# Altium project WR_NIC.PrjPcb (part 3 of 6)

## Sheet 09-DPLL-3.SchDoc
size B; SheetNumber: 9; SheetTotal: 22
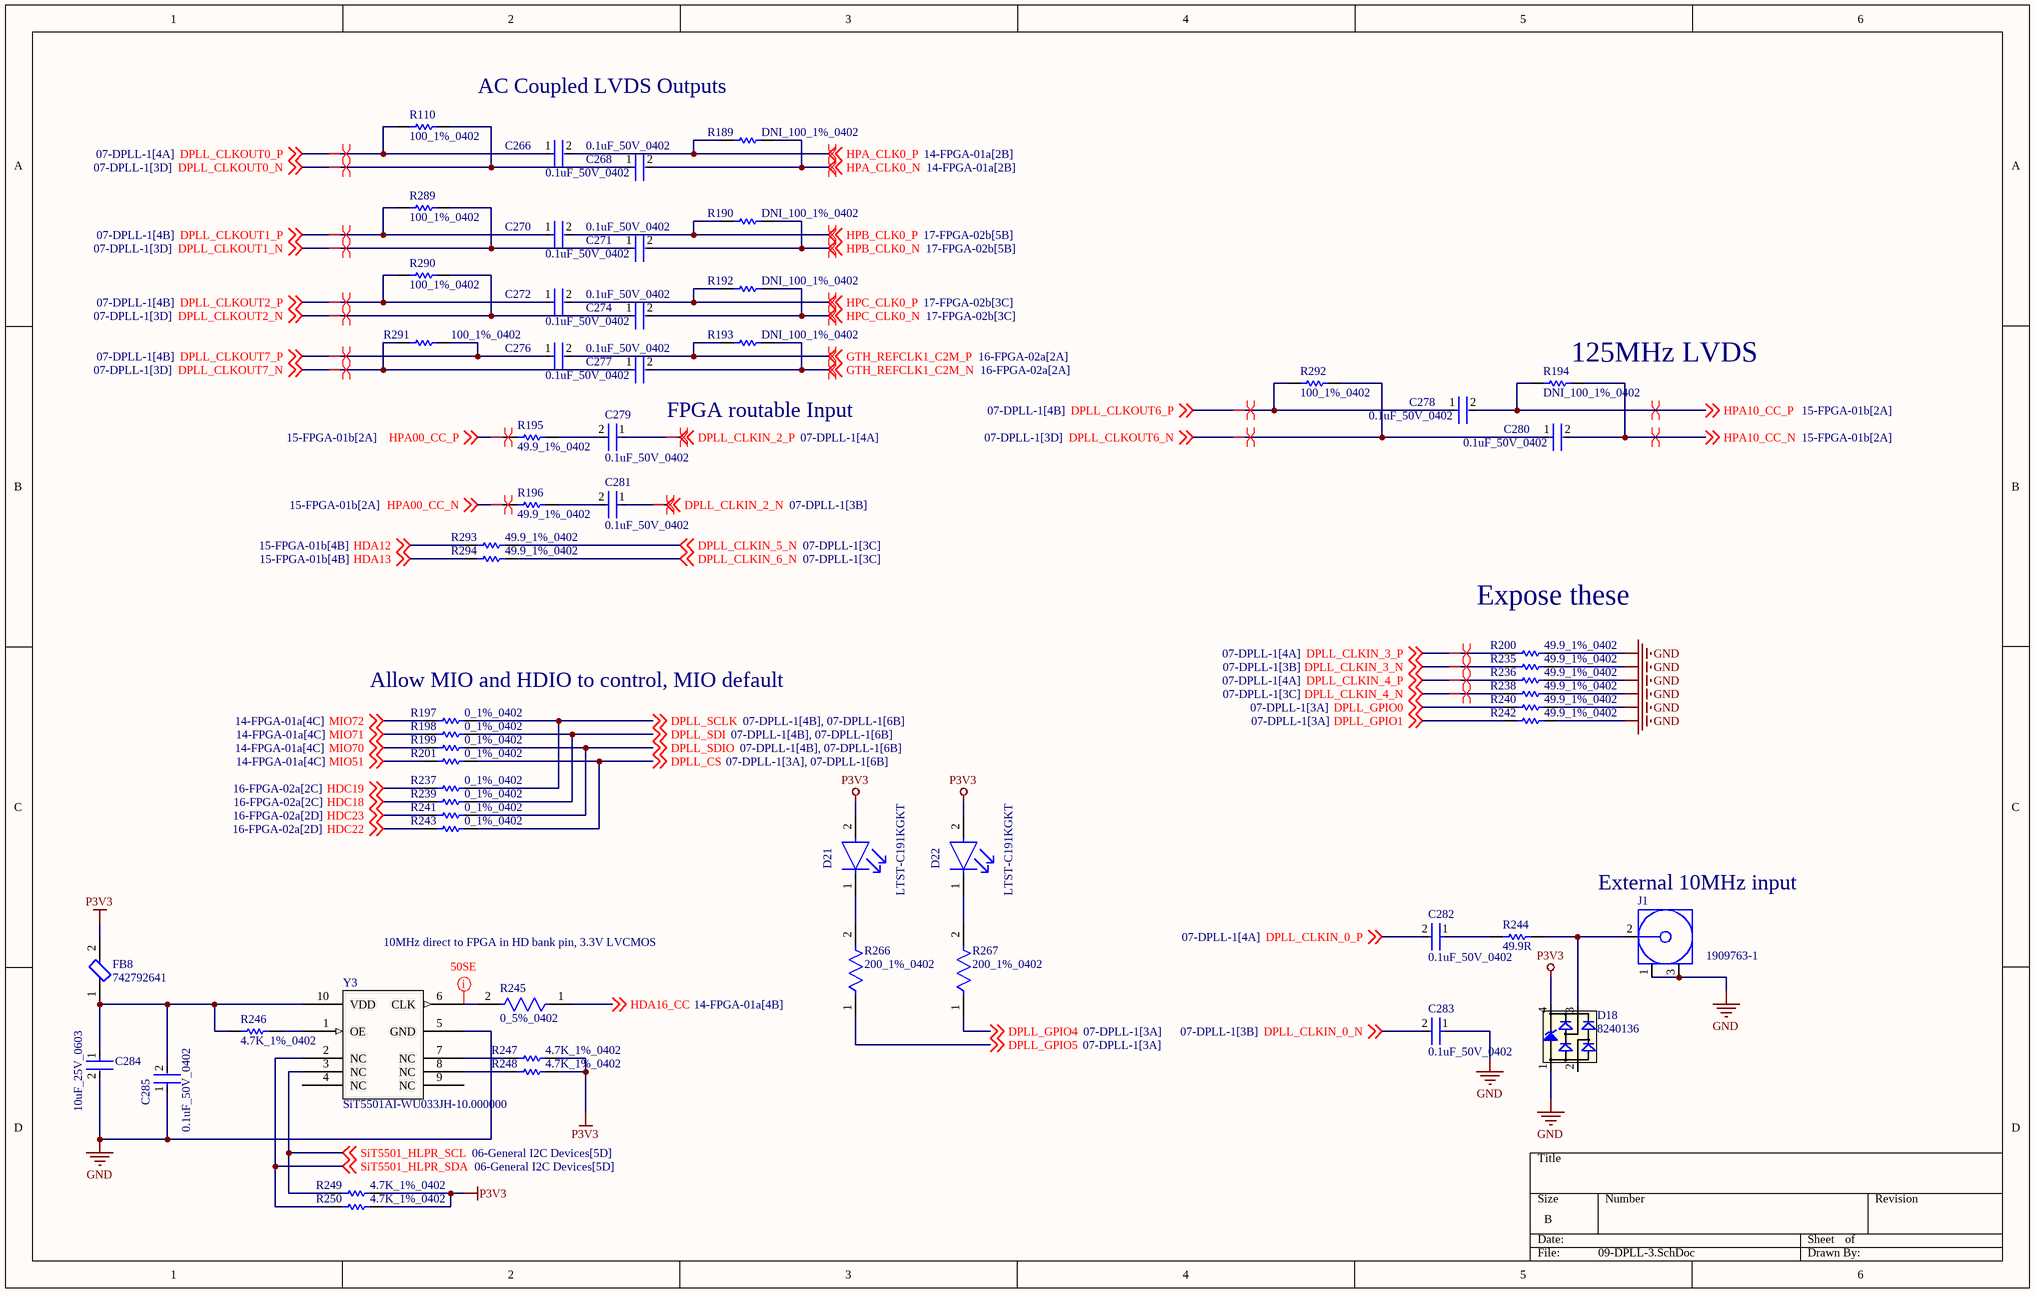
[diagram p8: 09-DPLL-3.SchDoc]

### Parts
C266  0.1uF_50V_0402  [FP-C1005-050-0_05-IPC_C]
C268  0.1uF_50V_0402  [FP-C1005-050-0_05-IPC_C]
C270  0.1uF_50V_0402  [FP-C1005-050-0_05-IPC_C]
C271  0.1uF_50V_0402  [FP-C1005-050-0_05-IPC_C]
C272  0.1uF_50V_0402  [FP-C1005-050-0_05-IPC_C]
C274  0.1uF_50V_0402  [FP-C1005-050-0_05-IPC_C]
C276  0.1uF_50V_0402  [FP-C1005-050-0_05-IPC_C]
C277  0.1uF_50V_0402  [FP-C1005-050-0_05-IPC_C]
C278  0.1uF_50V_0402  [FP-C1005-050-0_05-IPC_C]
C279  0.1uF_50V_0402  [FP-C1005-050-0_05-IPC_C]
C280  0.1uF_50V_0402  [FP-C1005-050-0_05-IPC_C]
C281  0.1uF_50V_0402  [FP-C1005-050-0_05-IPC_C]
C282  0.1uF_50V_0402  [FP-C1005-050-0_05-IPC_C]
C283  0.1uF_50V_0402  [FP-C1005-050-0_05-IPC_C]
C284  10uF_25V_0603  [FP-CL10-IPC_C]
C285  0.1uF_50V_0402  [FP-C1005-050-0_05-IPC_C]
D18  8240136  [SOT143-4L]
D21  LTST-C191KGKT  [FP-LTST-C191KGKT-MFG]
D22  LTST-C191KGKT  [FP-LTST-C191KGKT-MFG]
FB8  742792641  [FP-742792641-MFG]
J1  1909763-1  [TECO-1909763-1_V]
R110  100_1%_0402  [RESC1005X40X25ML05T10]
R189  DNI_100_1%_0402  [RESC1005X40X25LL05T05]  (no BOM)
R190  DNI_100_1%_0402  [RESC1005X40X25LL05T05]  (no BOM)
R192  DNI_100_1%_0402  [RESC1005X40X25LL05T05]  (no BOM)
R193  DNI_100_1%_0402  [RESC1005X40X25LL05T05]
R194  DNI_100_1%_0402  [RESC1005X40X25ML05T10]  (no BOM)
R195  49.9_1%_0402  [RESC1005X40X25NL10T10]
R196  49.9_1%_0402  [RESC1005X40X25NL10T10]
R197  0_1%_0402  [RESC1005X40X25LL05T05]
R198  0_1%_0402  [RESC1005X40X25LL05T05]
R199  0_1%_0402  [RESC1005X40X25LL05T05]
R200  49.9_1%_0402  [RESC1005X40X25NL10T10]
R201  0_1%_0402  [RESC1005X40X25LL05T05]
R235  49.9_1%_0402  [RESC1005X40X25NL10T10]
R236  49.9_1%_0402  [RESC1005X40X25NL10T10]
R237  0_1%_0402  [RESC1005X40X25LL05T05]
R238  49.9_1%_0402  [RESC1005X40X25NL10T10]
R239  0_1%_0402  [RESC1005X40X25LL05T05]
R240  49.9_1%_0402  [RESC1005X40X25NL10T10]
R241  0_1%_0402  [RESC1005X40X25LL05T05]
R242  49.9_1%_0402  [RESC1005X40X25NL10T10]
R243  0_1%_0402  [RESC1005X40X25LL05T05]
R244  49.9R  [RESC1608X55X25NL10T15]
R245  0_5%_0402  [FP-AC0402-0_37-IPC_B]
R246  4.7K_1%_0402  [RESC1005X40X25NL10T10]
R247  4.7K_1%_0402  [RESC1005X40X25NL10T10]
R248  4.7K_1%_0402  [RESC1005X40X25NL10T10]
R249  4.7K_1%_0402  [RESC1005X40X25NL10T10]
R250  4.7K_1%_0402  [RESC1005X40X25NL10T10]
R266  200_1%_0402  [FP-ERJ2RK-IPC_A]
R267  200_1%_0402  [FP-ERJ2RK-IPC_A]
R289  100_1%_0402  [RESC1005X40X25ML05T10]
R290  100_1%_0402  [RESC1005X40X25ML05T10]
R291  100_1%_0402  [RESC1005X40X25ML05T10]
R292  100_1%_0402  [RESC1005X40X25ML05T10]
R293  49.9_1%_0402  [RESC1005X40X25NL10T10]
R294  49.9_1%_0402  [RESC1005X40X25NL10T10]
Y3  Manufacturer Part Number: SiT5501AI-WU033JH-10.000000  [SITIME_SPL-086-CQFN-010-C07050_REV_DRAFT]  (hidden comment: SiTime_SiT5501AC-WU-33E0-10T)

### Nets
GND: C283.1 C284.2 C285.1 D18.1(GND) J1.1 J1.3 R200.2 R235.2 R236.2 R238.2 R240.2 R242.2 Y3.5(GND)
P3V3: D18.4(VDD) D21.2(A) D22.2(A) FB8.2 R247.2 R248.2 R249.2 R250.2
DPLL_CLKIN_0_N: C283.2 ; off-sheet DPLL_CLKIN_0_N
DPLL_CLKIN_0_P: C282.2 ; off-sheet DPLL_CLKIN_0_P
DPLL_CLKIN_2_N: C281.1 ; off-sheet DPLL_CLKIN_2_N
DPLL_CLKIN_2_P: C279.1 ; off-sheet DPLL_CLKIN_2_P
DPLL_CLKIN_3_N: R235.1 ; off-sheet DPLL_CLKIN_3_N
DPLL_CLKIN_3_P: R200.1 ; off-sheet DPLL_CLKIN_3_P
DPLL_CLKIN_4_N: R238.1 ; off-sheet DPLL_CLKIN_4_N
DPLL_CLKIN_4_P: R236.1 ; off-sheet DPLL_CLKIN_4_P
DPLL_CLKIN_5_N: R293.2 ; off-sheet DPLL_CLKIN_5_N
DPLL_CLKIN_6_N: R294.2 ; off-sheet DPLL_CLKIN_6_N
DPLL_CLKOUT0_N: C268.1 R110.2 ; off-sheet DPLL_CLKOUT0_N
DPLL_CLKOUT0_P: C266.1 R110.1 ; off-sheet DPLL_CLKOUT0_P
DPLL_CLKOUT1_N: C271.1 R289.2 ; off-sheet DPLL_CLKOUT1_N
DPLL_CLKOUT1_P: C270.1 R289.1 ; off-sheet DPLL_CLKOUT1_P
DPLL_CLKOUT2_N: C274.1 R290.2 ; off-sheet DPLL_CLKOUT2_N
DPLL_CLKOUT2_P: C272.1 R290.1 ; off-sheet DPLL_CLKOUT2_P
DPLL_CLKOUT6_N: C280.1 R292.2 ; off-sheet DPLL_CLKOUT6_N
DPLL_CLKOUT6_P: C278.1 R292.1 ; off-sheet DPLL_CLKOUT6_P
DPLL_CLKOUT7_N: C277.1 R291.1 ; off-sheet DPLL_CLKOUT7_N
DPLL_CLKOUT7_P: C276.1 R291.2 ; off-sheet DPLL_CLKOUT7_P
DPLL_CS: R201.2 R243.2 ; off-sheet DPLL_CS
DPLL_GPIO0: R240.1 ; off-sheet DPLL_GPIO0
DPLL_GPIO1: R242.1 ; off-sheet DPLL_GPIO1
DPLL_GPIO4: R267.1 ; off-sheet DPLL_GPIO4
DPLL_GPIO5: R266.1 ; off-sheet DPLL_GPIO5
DPLL_SCLK: R197.2 R237.2 ; off-sheet DPLL_SCLK
DPLL_SDI: R198.2 R239.2 ; off-sheet DPLL_SDI
DPLL_SDIO: R199.2 R241.2 ; off-sheet DPLL_SDIO
GTH_REFCLK1_C2M_N: C277.2 R193.2 ; off-sheet GTH_REFCLK1_C2M_N
GTH_REFCLK1_C2M_P: C276.2 R193.1 ; off-sheet GTH_REFCLK1_C2M_P
HDA12: R293.1 ; off-sheet HDA12
HDA13: R294.1 ; off-sheet HDA13
HDA16_CC: R245.1 ; off-sheet HDA16_CC
HDC18: R239.1 ; off-sheet HDC18
HDC19: R237.1 ; off-sheet HDC19
HDC22: R243.1 ; off-sheet HDC22
HDC23: R241.1 ; off-sheet HDC23
HPA00_CC_N: R196.1 ; off-sheet HPA00_CC_N
HPA00_CC_P: R195.1 ; off-sheet HPA00_CC_P
HPA10_CC_N: C280.2 R194.2 ; off-sheet HPA10_CC_N
HPA10_CC_P: C278.2 R194.1 ; off-sheet HPA10_CC_P
HPA_CLK0_N: C268.2 R189.2 ; off-sheet HPA_CLK0_N
HPA_CLK0_P: C266.2 R189.1 ; off-sheet HPA_CLK0_P
HPB_CLK0_N: C271.2 R190.2 ; off-sheet HPB_CLK0_N
HPB_CLK0_P: C270.2 R190.1 ; off-sheet HPB_CLK0_P
HPC_CLK0_N: C274.2 R192.2 ; off-sheet HPC_CLK0_N
HPC_CLK0_P: C272.2 R192.1 ; off-sheet HPC_CLK0_P
MIO51: R201.1 ; off-sheet MIO51
MIO70: R199.1 ; off-sheet MIO70
MIO71: R198.1 ; off-sheet MIO71
MIO72: R197.1 ; off-sheet MIO72
SiT5501_HLPR_SCL: R249.1 Y3.3(NC) ; off-sheet SiT5501_HLPR_SCL
SiT5501_HLPR_SDA: R250.1 Y3.2(NC) ; off-sheet SiT5501_HLPR_SDA
NetC279_2: C279.2 R195.2
NetC281_2: C281.2 R196.2
NetC282_1: C282.1 R244.1
NetC284_1: C284.1 C285.2 FB8.1 R246.2 Y3.10(VDD)
NetD18_3: D18.3(I/O2) J1.2 R244.2
NetD21_1: D21.1(C) R266.2
NetD22_1: D22.1(C) R267.2
NetR245_2: R245.2 Y3.6(CLK)
NetR246_1: R246.1 Y3.1(OE)
NetR247_1: R247.1 Y3.7(NC)
NetR248_1: R248.1 Y3.8(NC)

Not connected (* = marked no-connect by the designer): D18 2(I/O1); Y3 4(NC) 9(NC)

### Layout directives
differential pair: DPLL_CLKIN_2_N, DPLL_CLKIN_2_P, DPLL_CLKIN_3_N, DPLL_CLKIN_3_P, DPLL_CLKIN_4_N, DPLL_CLKIN_4_P, DPLL_CLKOUT0_N, DPLL_CLKOUT0_P, DPLL_CLKOUT1_N, DPLL_CLKOUT1_P, DPLL_CLKOUT2_N, DPLL_CLKOUT2_P, DPLL_CLKOUT6_N, DPLL_CLKOUT6_P, DPLL_CLKOUT7_N, DPLL_CLKOUT7_P, GTH_REFCLK1_C2M_N, GTH_REFCLK1_C2M_P, HPA00_CC_N, HPA00_CC_P, HPA10_CC_N, HPA10_CC_P, HPA_CLK0_N, HPA_CLK0_P, HPB_CLK0_N, HPB_CLK0_P, HPC_CLK0_N, HPC_CLK0_P
net class 50SE: NetR245_2

### Notes on the sheet
- AC Coupled LVDS Outputs
- (near R194) 125MHz LVDS
- FPGA routable Input
- Expose these
- Allow MIO and HDIO to control, MIO default
- (near J1) External 10MHz input
- 10MHz direct to FPGA in HD bank pin, 3.3V LVCMOS

### Library data of the parts
C266 C268 C270-C272 C274 C276-C283 C285 = CMP-2000-05393-2: Multilayer Ceramic Capacitors 100nF ±10% 50V X7R SMD 0402; Voltage: 50V; Dielectric Material: Ceramic; Min Operating Temperature: -55°C; Depth: 0.5mm; Radiation Hardening: No; RoHS Compliant: Yes; Voltage Rating (DC): 50V; Lead Free: Lead Free; Resistor Type: Ceramic; Height: 0.5mm; Dielectric: X7R; Thickness: 0.022inch; Case/Package: 0402; Case Code (Metric): 1005; Termination: SMD/SMT; Capacitance: 100nF; Packaging: Tape and Reel; Max Operating Temperature: 125°C; Mount: Surface Mount; Package Quantity: 1; Width: 0.02inch; Weight: 2.3E-05oz; Voltage Rating: 50V; Tolerance: 10%; Construction: Flat; Case Code (Imperial): 0402; Length: 1mm; REACH SVHC: No SVHC; Series: C
C284 = CMP-13271-004224-1: Cap Ceramic 10uF 25V X5R ±20% Pad SMD 0603 +85°C T/R; Width: 0.031inch; Voltage Rating: 25V; Length: 0.063inch; Case Code (Metric): 1608; Dielectric: X5R; Termination: Wraparound; Capacitance: 10uF; Lead Free: Lead Free; Mount: Surface Mount; Package Quantity: 1; Case Code (Imperial): 0603; Thickness: 0.035inch; Packaging: Tape and Reel; Contact Plating: Tin; Min Operating Temperature: -55°C; Tolerance: 20%; Max Operating Temperature: 85°C; Case/Package: 0603
D18 = CMP-1486-00002-1: TVS Diode WE-TVS-HS, VRWM=3.3V; Manufacturer: Wuerth Elektronik; Reverse Stand Off Voltage: 3.3V; PartNumber: 8240136; ComponentLink1Description: Manufacturer URL; PackageReference: SOT143-4L; ComponentLink1URL: http://www.we-online.com; ComponentLink2Description: Datasheet; ComponentLink2URL: http://katalog.we-online.de/kataloge/eisos/media/pdf/8240136.pdf
D21 D22 = CMP-2000-05198-2: LED GREEN CLEAR SMD; Max Power Dissipation: 75mW; Forward Current: 30mA; Reverse Voltage: 5V; Lens Color: Colorless; Forward Voltage: 2V; Dominant Wavelength: 571nm; Number of LEDs: 1; Viewing Angle: 130°; Lens Style: Rectangular; Test Current: 20mA; Luminous Intensity: 35mcd; Wavelength: 574nm; Width: 0.8mm; Case Code (Imperial): 0603; Number of Pins: 2; Lead Free: Lead Free; Packaging: Tape and Reel; Package Quantity: 1; Min Operating Temperature: -55°C; Case/Package: 0603; Length: 1.6mm; Power Dissipation: 75mW; Depth: 0.8mm; Radiation Hardening: No; Mount: Surface Mount; Max Operating Temperature: 85°C; Color: Green; Power Rating: 75mW; Height: 0.55mm; Illumination Color: Green; Case Code (Metric): 1608; Lens Transparency: Clear; Number of Elements: 1
FB8 = CMP-0220-00171-2: FERRITE BEAD 300 OHM 0603 1LN; Inductance: 18nH; Max DC Current: 2A; Number of Lines: 1; Test Frequency: 100MHz; Impedance: 300R; DC Resistance (DCR): 150mR; Tolerance: 25%; Case Code (Metric): 1608; Core Material: Ferrite; Length: 1.6mm; Lead Free: Lead Free; Series: WE-CBF; Min Operating Temperature: -55°C; RoHS Compliant: Yes; Case/Package: SMD/SMT; Material: Ferrite; Max Operating Temperature: 125°C; Termination: SMD/SMT; Packaging: Tape and Reel; Weight: 0.000141oz; Case Code (Imperial): 0603; Width: 0.8mm; Mount: Surface Mount; Max Current Rating: 2A; Package Quantity: 1; Depth: 0.8mm; Current Rating: 2A; Height: 0.8mm
J1 = CMP-2000-07505-1: Ultra Miniature Coaxial Connector Jack, 60 V, 50 Ohm, -40 to 90 degC, RoHS, Tape and Reel; Manufacturer: TE Connectivity; Gender: Female; PCB Mounting Orientation: Vertical; Body Material: LiquidCrystalPolymer; Case\/Package: SMD/SMT; Impedance: 50Ohm; Max Frequency: 6GHz; Body Plating: Gold; Dielectric Material: Polymer; Orientation: Straight; Mount: SurfaceMount; Length: 3mm; Packaging: TapeandReel; Connector Type: Jack; Lead Free: LeadFree; Package Quantity: 1; Termination: SMD/SMT; Contact Material: CopperAlloy; Fastening Type: Pull; RoHSCompliant: true; Max Operating Temperature: 90degC; Datasheet URL: http://www.te.com/commerce/DocumentDelivery/DDEController?Action=srchrtrv&DocNm=1909763&DocType=Customer+Drawing&DocLang=English; Contact Plating: Gold; Mounting Technology: SurfaceMount; Package Reference: TECO-1909763-1; Insulation Material: Thermoplastic; Min Operating Temperature: -40degC; Manufacturer URL: http://www.te.com/; ELV: Compliant; Datasheet Version: Rev. B2, 11/2015; Radiation Hardening: No; Package Description: 3-Pin Surface Mount Device, Body 2.6 x 2.6 mm; Housing Colour: Beige
R110 R194 R289-R292 = CMP-2002-06458-1: Part Number: ERJ-U02F1000X; Manufacturer: Panasonic
R189 R190 R192 R193 = CMP-2002-00605-3: Chip Resistor, 100 Ohm, +/- 1%, 100 mW, -55 to 155 degC, 0402 (1005 Metric), RoHS, Tape and Reel; Manufacturer: Basic Passives; PartNumber: ERJ-2RKF1000X; Power Rating: 100 mW; Resistance: 100 Ohm; Voltage Rating: 50 V; Case\/Package: 0402; Width: 0.5 mm; Pins: 2; ComponentLink2Description: Datasheet; PackageReference: 0402; Height: 0.35 mm; Tolerance: 1%; DatasheetVersion: 04/2015; Case Code (Imperial): 0402; Min Operating Temperature: -55 degC; Radiation Hardening: No; Length: 1 mm; Package Quantity: 10000; PackageDescription: 2-Pin Surface Mount Device, Body 1 x 0.5 mm; Mounting Technology: Surface Mount; Case Code (Metric): 1005; Packaging: Tape and Reel; ComponentLink1URL: http://www.panasonic.com/; RoHSCompliant: true; Max Operating Temperature: 155 degC; REACH SVHC: Yes; ComponentLink1Description: Manufacturer URL; ComponentLink2URL: http://industrial.panasonic.com/cdbs/www-data/pdf/RDA0000/AOA0000C86.pdf; Mount: Surface Mount
R195 R196 R200 R235 R236 R238 R240 R242 R293 R294 = CMP-2002-04448-1: Part Number: RK73H1ETTP49R9F; Manufacturer: KOA Speer
R197-R199 R201 R237 R239 R241 R243 = CMP-2000-07451-1: Chip Resistor, 0 Ohm, 0.1 W, -55 to 155 degC, 0402 (1005 Metric), RoHS, Tape and Reel; Manufacturer: Panasonic; Voltage Rating (DC): 50V; Temperature Coefficient: 600ppm/��C; Max Power Dissipation: 100mW; Resistance: 0mOhm; Tolerance: 5%; Number of Terminations: 2; Mount: SurfaceMount; Height: 0.35mm; Packaging: TapeandReel; Contact Plating: Tin; Manufacturer URL: http://www.panasonic.com/; Composition: ThickFilm; Max Operating Temperature: 155degC; REACH SVHC: NoSVHC; Case/Package: 0402; Package Reference: 402; Depth: 0.5mm; Package Description: 2-Pin Surface Mount Device, Body 1 x 0.5 mm; Datasheet URL: https://industrial.panasonic.com/cdbs/www-data/pdf/RDA0000/AOA0000C301.pdf; RoHSCompliant: True; Case Code (Imperial): 0402; Military Standard: Not; Min Operating Temperature: -55degC; Power Rating: 100mW; Datasheet Version: 03/2015; Length: 1mm; Case Code (Metric): 1005; Termination: SMD/SMT; Mounting Technology: SurfaceMount; Voltage Rating: 50V; Width: 0.02inch; Package Quantity: 1; Lead Free: LeadFree; Radiation Hardening: No
R244 = CMP-1659-00036-1: General Purpose Chip Resistor, 49.9 Ohm, +/- 1%, -55 to 155 degC, 0603 (1608 Metric), RoHS, Tape and Reel; Max Supply Voltage: 3.63 V; Case\Package: LQFP; Interface: SPI; Min Supply Voltage: 2.97 V; PackageReference: 0603; Packaging: Tray; ComponentLink2Description: Datasheet; ComponentLink1Description: Manufacturer URL; ComponentLink2URL: https://datasheet.ciiva.com/11808/0900766b80f96399-11808223.pdf; RoHSCompliant: true; Max Operating Temperature: 85 degC; ComponentLink1URL: http://www.yageo.com/; PackageDescription: 2-Pin Surface Mount Device, Body 1.6 x 0.8 mm; DatasheetVersion: Rev. 4, 04/2009; Min Operating Temperature: -40 degC; Package Quantity: 250; Pins: 48
R245 = CMP-2002-01772-2: RESISTOR 0402 JUMPER ZERO OHM; Voltage Rating: 50V; Temperature Coefficient: 200ppm/°C; Tolerance: 1%; Power Rating: 62.5mW; Resistance: 0R; Min Operating Temperature: -55°C; Termination: SMD/SMT; Case/Package: 0402; Case Code (Imperial): 0402; Packaging: Tape and Reel; Case Code (Metric): 1005; Max Operating Temperature: 155°C; Series: AC
R246-R250 = CMP-2002-05217-1: Manufacturer: Bourns; Part Number: CR0402-FX-4701GLF
R266 R267 = CMP-2002-00757-2: RES SMD 200 OHM 1% 1/10W 0402; Power Rating: 100mW; Voltage Rating (DC): 50V; Resistance: 200R; Temperature Coefficient: 100ppm/°C; RoHS Compliant: Yes; Packaging: Tape and Reel; Case Code (Metric): 1005; Package Quantity: 1; Contact Plating: Tin; Series: ERJ; Mount: Surface Mount; Lead Free: Lead Free; Min Operating Temperature: -55°C; Number of Terminations: 2; Max Power Dissipation: 100mW; Technology: THICK FILM; Voltage Rating: 50V; Case/Package: 0402; Width: 0.02inch; Termination: SMD/SMT; Military Standard: Not; Height: 0.35mm; Radiation Hardening: No; Resistance Tolerance: 1%; Length: 1mm; REACH SVHC: No SVHC; Construction: Rectangular; Depth: 0.5mm; Features: Automotive AEC-Q200; Resistor Type: Thick Film; Case Code (Imperial): 0402; Tolerance: 1%; Size Code: 0402; Max Operating Temperature: 155°C
Y3 = CMP-OSC-00029-2: OSC, MEMS, STRATUM 3E, 10.000MHZ, 10PPB STAB, LVCMOS, 3.3V, O/P EN, 7.0X5.0X2.2MM, CQFN-10; Manufacturer: SiTime; Frequency: 10 MHz; Voltage - Supply: 3.3 V; Type: OCXO; Category: Oscillators; Max Operating Temperature: 70°C; Min Operating Temperature: -20°C; Height: 2.20mm (max); Case/Package: 10 Lead QFN; Output: LVCMOS; Mounting Type: Surface Mount; Frequency Stability: ±10 ppb; RoHS: Yes

## Sheet 10-JTAG.SchDoc
size C; SheetNumber: 10; SheetTotal: 22
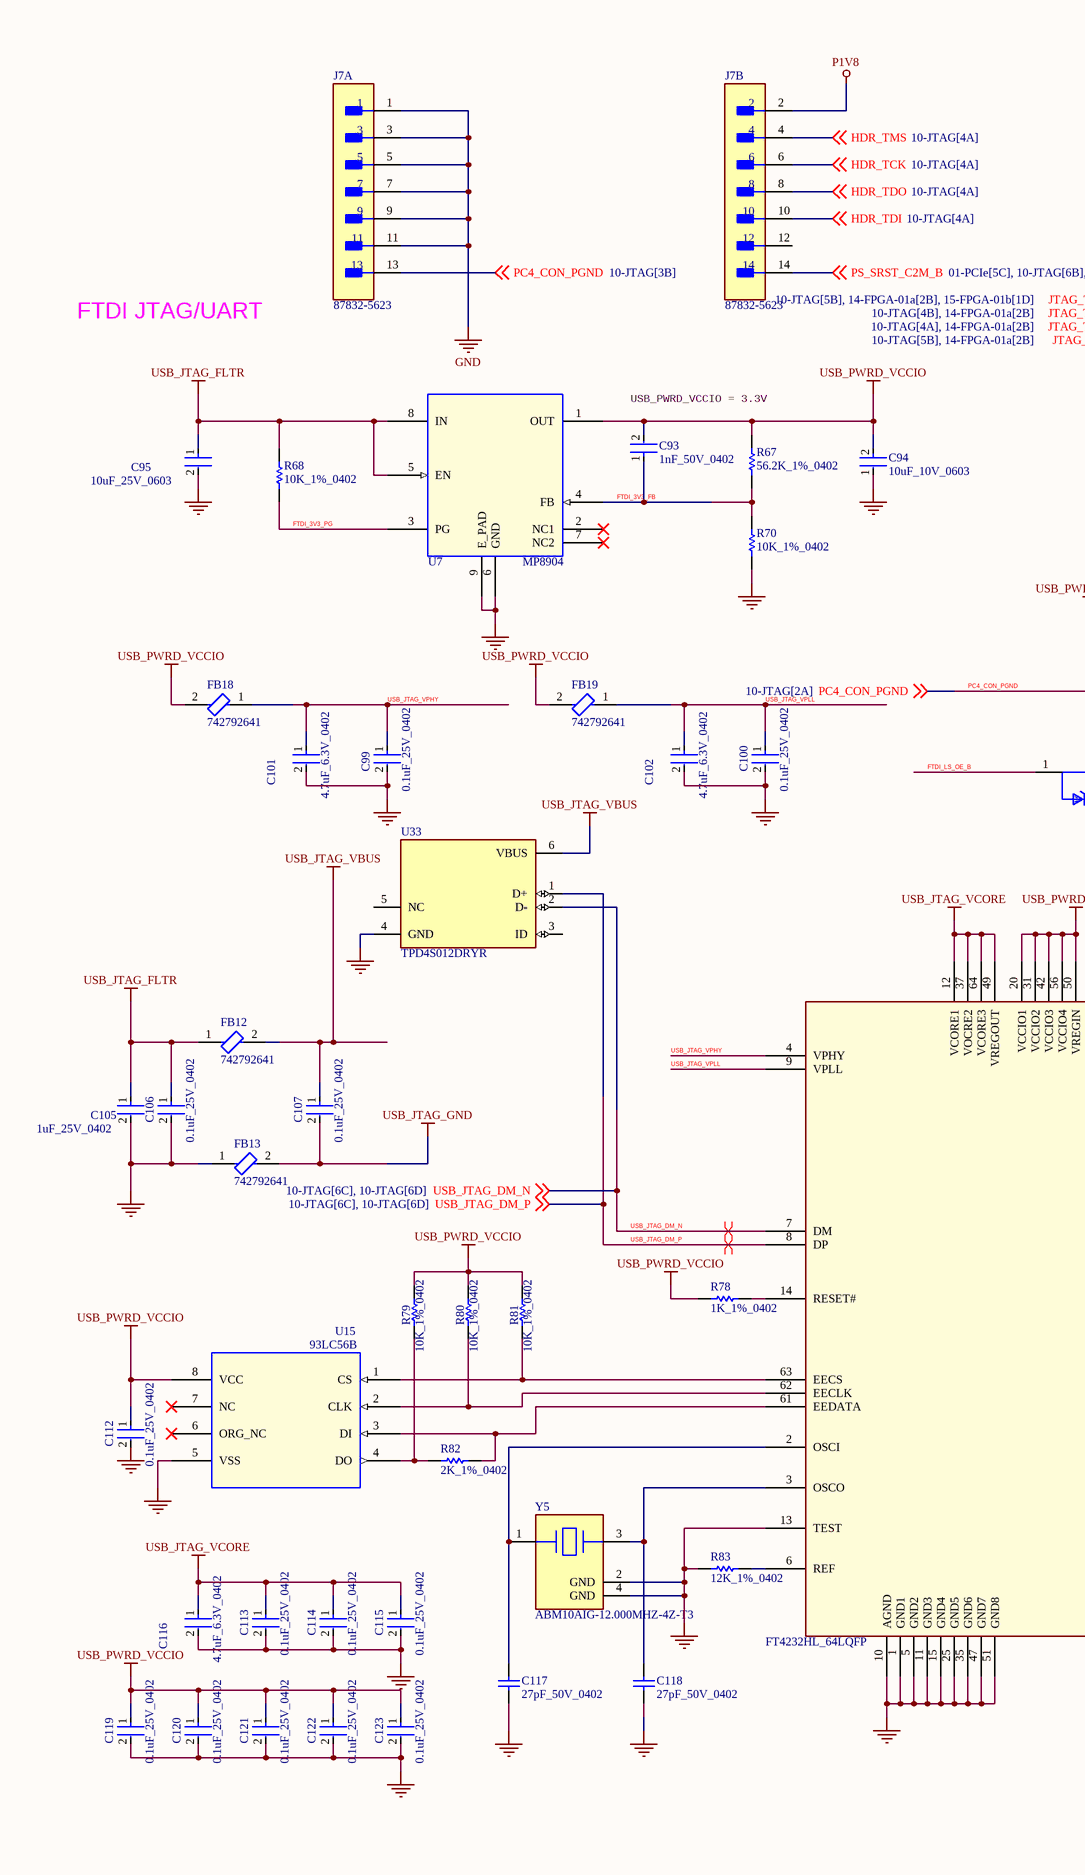
[diagram p9: 10-JTAG.SchDoc, left]
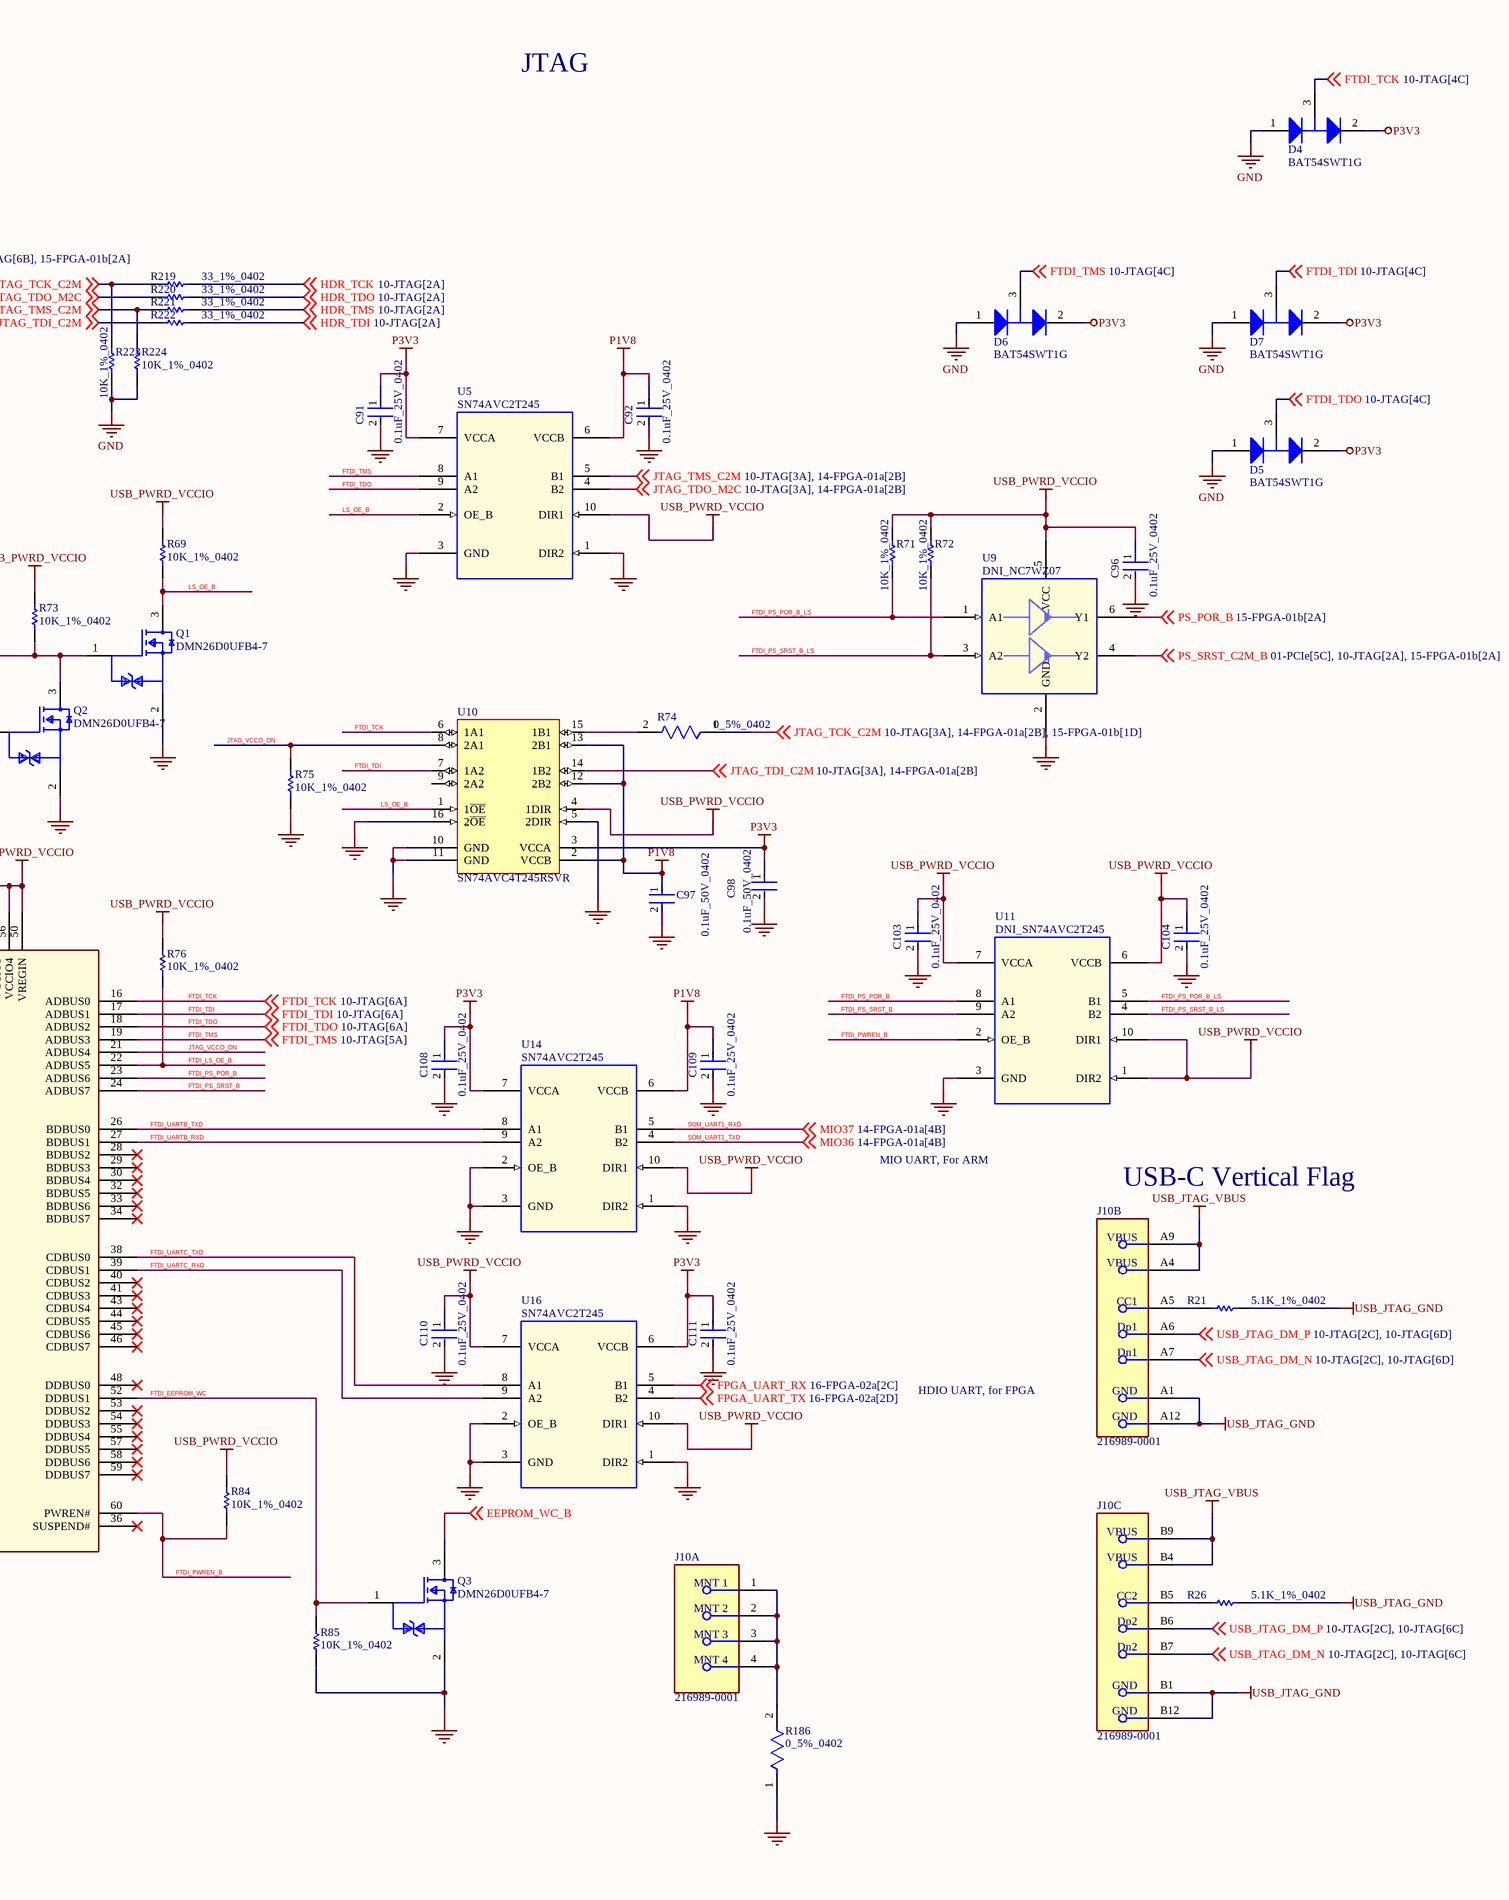
[diagram p10: 10-JTAG.SchDoc, right]

### Parts
C91  0.1uF_25V_0402  [FP-0402-L_1_0_1-W_0_5_0_1-IPC_C]
C92  0.1uF_25V_0402  [FP-0402-L_1_0_1-W_0_5_0_1-IPC_C]
C93  1nF_50V_0402  [FP-CGA2B-MFG]
C94  10uF_10V_0603  [FP-C1608-080-0_1-MFG]
C95  10uF_25V_0603  [FP-CL10-IPC_C]
C96  0.1uF_25V_0402  [FP-0402-L_1_0_1-W_0_5_0_1-IPC_C]
C97  0.1uF_50V_0402  [FP-C1005-050-0_05-IPC_C]
C98  0.1uF_50V_0402  [FP-C1005-050-0_05-IPC_C]
C99  0.1uF_25V_0402  [FP-0402-L_1_0_1-W_0_5_0_1-IPC_C]
C100  0.1uF_25V_0402  [FP-0402-L_1_0_1-W_0_5_0_1-IPC_C]
C101  4.7uF_6.3V_0402  [FP-C1005-050-0_15-IPC_C]
C102  4.7uF_6.3V_0402  [FP-C1005-050-0_15-IPC_C]
C103  0.1uF_25V_0402  [FP-0402-L_1_0_1-W_0_5_0_1-IPC_C]
C104  0.1uF_25V_0402  [FP-0402-L_1_0_1-W_0_5_0_1-IPC_C]
C105  1uF_25V_0402  [FP-CL542-IPC_C]
C106  0.1uF_25V_0402  [FP-0402-L_1_0_1-W_0_5_0_1-IPC_C]
C107  0.1uF_25V_0402  [FP-0402-L_1_0_1-W_0_5_0_1-IPC_C]
C108  0.1uF_25V_0402  [FP-0402-L_1_0_1-W_0_5_0_1-IPC_C]
C109  0.1uF_25V_0402  [FP-0402-L_1_0_1-W_0_5_0_1-IPC_C]
C110  0.1uF_25V_0402  [FP-0402-L_1_0_1-W_0_5_0_1-IPC_C]
C111  0.1uF_25V_0402  [FP-0402-L_1_0_1-W_0_5_0_1-IPC_C]
C112  0.1uF_25V_0402  [FP-0402-L_1_0_1-W_0_5_0_1-IPC_C]
C113  0.1uF_25V_0402  [FP-0402-L_1_0_1-W_0_5_0_1-IPC_C]
C114  0.1uF_25V_0402  [FP-0402-L_1_0_1-W_0_5_0_1-IPC_C]
C115  0.1uF_25V_0402  [FP-0402-L_1_0_1-W_0_5_0_1-IPC_C]
C116  4.7uF_6.3V_0402  [FP-C1005-050-0_15-IPC_C]
C117  27pF_50V_0402  [CAPC1005X55X25LL05T10]
C118  27pF_50V_0402  [CAPC1005X55X25LL05T10]
C119  0.1uF_25V_0402  [FP-0402-L_1_0_1-W_0_5_0_1-IPC_C]
C120  0.1uF_25V_0402  [FP-0402-L_1_0_1-W_0_5_0_1-IPC_C]
C121  0.1uF_25V_0402  [FP-0402-L_1_0_1-W_0_5_0_1-IPC_C]
C122  0.1uF_25V_0402  [FP-0402-L_1_0_1-W_0_5_0_1-IPC_C]
C123  0.1uF_25V_0402  [FP-0402-L_1_0_1-W_0_5_0_1-IPC_C]
D4  BAT54SWT1G  [ONSC-SOT-323-3-419-04_V]
D5  BAT54SWT1G  [ONSC-SOT-323-3-419-04_V]
D6  BAT54SWT1G  [ONSC-SOT-323-3-419-04_V]
D7  BAT54SWT1G  [ONSC-SOT-323-3-419-04_V]
FB12  742792641  [FP-742792641-MFG]
FB13  742792641  [FP-742792641-MFG]
FB18  742792641  [FP-742792641-MFG]
FB19  742792641  [FP-742792641-MFG]
J7  87832-5623  [FP-87832-5623-MFG]  (parts A,B of 2)
J10  216989-0001  [FP-216989-0001-MFG]  (parts A,B,C of 3)
Q1  DMN26D0UFB4-7  [FP-X2-DFN1006-3-MFG]
Q2  DMN26D0UFB4-7  [FP-X2-DFN1006-3-MFG]
Q3  DMN26D0UFB4-7  [FP-X2-DFN1006-3-MFG]
R21  5.1K_1%_0402  [RESC1005X40X25ML10T10]
R26  5.1K_1%_0402  [RESC1005X40X25ML10T10]
R67  56.2K_1%_0402  [RESC1005X40X25LL05T05]
R68  10K_1%_0402  [RESC1005X40X25ML05T05]
R69  10K_1%_0402  [RESC1005X40X25ML05T05]
R70  10K_1%_0402  [RESC1005X40X25ML05T05]
R71  10K_1%_0402  [RESC1005X40X25ML05T05]
R72  10K_1%_0402  [RESC1005X40X25ML05T05]
R73  10K_1%_0402  [RESC1005X40X25ML05T05]
R74  0_5%_0402  [FP-AC0402-0_37-IPC_B]
R75  10K_1%_0402  [RESC1005X40X25ML05T05]
R76  10K_1%_0402  [RESC1005X40X25ML05T05]
R78  1K_1%_0402  [RESC1005X40X25NL05T05]
R79  10K_1%_0402  [RESC1005X40X25ML05T05]
R80  10K_1%_0402  [RESC1005X40X25ML05T05]
R81  10K_1%_0402  [RESC1005X40X25ML05T05]
R82  2K_1%_0402  [RESC1005X40X25LL10T10]
R83  12K_1%_0402  [RESC1005X40X25ML10T10]
R84  10K_1%_0402  [RESC1005X40X25ML05T05]
R85  10K_1%_0402  [RESC1005X40X25ML05T05]
R186  0_5%_0402  [FP-AC0402-0_37-IPC_B]
R219  33_1%_0402  [RESC1005X40X25NL05T10]
R220  33_1%_0402  [RESC1005X40X25NL05T10]
R221  33_1%_0402  [RESC1005X40X25NL05T10]
R222  33_1%_0402  [RESC1005X40X25NL05T10]
R223  10K_1%_0402  [RESC1005X40X25ML05T05]
R224  10K_1%_0402  [RESC1005X40X25ML05T05]
U5  SN74AVC2T245  [QFN40P140X180X55-10]
U7  MP8904  [QFN_MP8904DD_8]
U9  DNI_NC7WZ07  [SC70_6]
U10  SN74AVC4T245RSVR  [RSV0016A_V]
U11  DNI_SN74AVC2T245  [QFN40P140X180X55-10]  (no BOM)
U13  FT4232HL_64LQFP  [LQFP_64]
U14  SN74AVC2T245  [QFN40P140X180X55-10]
U15  93LC56B  [SOIC8P127W390]
U16  SN74AVC2T245  [QFN40P140X180X55-10]
U33  TPD4S012DRYR  [FP-DRY0006A-MFG]
Y5  ABM10AIG-12.000MHZ-4Z-T3  [FP-ABM10AIG-MFG]

### Nets
GND: C91.2 C92.2 C94.1 C95.2 C96.2 C97.2 C98.2 C99.2 C100.2 C101.2 C102.2 C103.2 C104.2 C105.2 C106.2 C108.2 C109.2 C110.2 C111.2 C112.2 C113.2 C114.2 C115.2 C116.2 C117.1 C118.1 C119.2 C120.2 C121.2 C122.2 C123.2 D4.1(A) D5.1(A) D6.1(A) D7.1(A) FB13.1 J7.1 J7.3 J7.5 J7.7 J7.9 J7.11 Q1.2(S) Q2.2(S) Q3.2(S) R70.1 R75.1 R83.1 R85.1 R186.1 R223.1 R224.1 U5.1(DIR2) U5.3(GND) U7.6(GND) U7.9(E_PAD) U9.2(GND) U10.5(2DIR) U10.10(GND) U10.11(GND) U10.16(2~{OE}) U11.3(GND) U13.1(GND1) U13.5(GND2) U13.10(AGND) U13.11(GND3) U13.13(TEST) U13.15(GND4) U13.25(GND5) U13.35(GND6) U13.47(GND7) U13.51(GND8) U14.1(DIR2) U14.2(OE_B) U14.3(GND) U15.5(VSS) U16.1(DIR2) U16.2(OE_B) U16.3(GND) U33.4(GND) Y5.2(GND) Y5.4(GND)
P1V8: C92.1 C97.1 C109.1 J7.2 U5.6(VCCB) U10.2(VCCB) U10.12(2B2) U10.13(2B1) U14.6(VCCB)
P3V3: C91.1 C98.1 C108.1 C111.1 D4.2(K) D5.2(K) D6.2(K) D7.2(K) U5.7(VCCA) U10.3(VCCA) U14.7(VCCA) U16.6(VCCB)
USB_JTAG_FLTR: C95.1 C105.1 C106.1 FB12.1 R68.2 U7.5(EN) U7.8(IN)
USB_JTAG_GND: C107.2 FB13.2 J10.A1(GND) J10.A12(GND) J10.B1(GND) J10.B12(GND) R21.2 R26.2
USB_JTAG_VBUS: C107.1 FB12.2 J10.A4(VBUS) J10.A9(VBUS) J10.B4(VBUS) J10.B9(VBUS) U33.6(VBUS)
USB_JTAG_VCORE: C113.1 C114.1 C115.1 C116.1 U13.12(VCORE1) U13.37(VOCRE2) U13.49(VREGOUT) U13.64(VCORE3)
USB_PWRD_VCCIO: C93.2 C94.2 C96.1 C103.1 C104.1 C110.1 C112.1 C119.1 C120.1 C121.1 C122.1 C123.1 FB18.2 FB19.2 R67.2 R69.2 R71.2 R72.2 R73.2 R76.2 R78.1 R79.2 R80.2 R81.2 R84.2 U5.10(DIR1) U7.1(OUT) U9.5(VCC) U10.4(1DIR) U11.1(DIR2) U11.6(VCCB) U11.7(VCCA) U11.10(DIR1) U13.20(VCCIO1) U13.31(VCCIO2) U13.42(VCCIO3) U13.50(VREGIN) U13.56(VCCIO4) U14.10(DIR1) U15.8(VCC) U16.7(VCCA) U16.10(DIR1)
EEPROM_WC_B: Q3.3(D) ; off-sheet EEPROM_WC_B
FPGA_UART_RX: U16.5(B1) ; off-sheet FPGA_UART_RX
FPGA_UART_TX: U16.4(B2) ; off-sheet FPGA_UART_TX
FTDI_3V3_FB: C93.1 R67.1 R70.2 U7.4(FB)
FTDI_3V3_PG: R68.1 U7.3(PG)
FTDI_EEPROM_WC: Q3.1(G) R85.2 U13.52(DDBUS1)
FTDI_LS_OE_B: Q2.1(G) R76.1 U13.22(ADBUS5)
FTDI_PS_POR_B: U11.8(A1) U13.23(ADBUS6)
FTDI_PS_POR_B_LS: R71.1 U9.1(A1) U11.5(B1)
FTDI_PS_SRST_B: U11.9(A2) U13.24(ADBUS7)
FTDI_PS_SRST_B_LS: R72.1 U9.3(A2) U11.4(B2)
FTDI_PWREN_B: R84.1 U11.2(OE_B) U13.60(PWREN#)
FTDI_TCK: D4.3(K/A) U10.6(1A1) U13.16(ADBUS0) ; off-sheet FTDI_TCK
FTDI_TDI: D7.3(K/A) U10.7(1A2) U13.17(ADBUS1) ; off-sheet FTDI_TDI
FTDI_TDO: D5.3(K/A) U5.9(A2) U13.18(ADBUS2) ; off-sheet FTDI_TDO
FTDI_TMS: D6.3(K/A) U5.8(A1) U13.19(ADBUS3) ; off-sheet FTDI_TMS
FTDI_UARTB_RXD: U13.27(BDBUS1) U14.9(A2)
FTDI_UARTB_TXD: U13.26(BDBUS0) U14.8(A1)
FTDI_UARTC_RXD: U13.39(CDBUS1) U16.9(A2)
FTDI_UARTC_TXD: U13.38(CDBUS0) U16.8(A1)
HDR_TCK: J7.6 R219.2 ; off-sheet HDR_TCK
HDR_TDI: J7.10 R222.2 ; off-sheet HDR_TDI
HDR_TDO: J7.8 R220.2 ; off-sheet HDR_TDO
HDR_TMS: J7.4 R221.2 ; off-sheet HDR_TMS
JTAG_TCK_C2M: R74.1 R219.1 R223.2 ; off-sheet JTAG_TCK_C2M
JTAG_TDI_C2M: R222.1 U10.14(1B2) ; off-sheet JTAG_TDI_C2M
JTAG_TDO_M2C: R220.1 U5.4(B2) ; off-sheet JTAG_TDO_M2C
JTAG_TMS_C2M: R221.1 R224.2 U5.5(B1) ; off-sheet JTAG_TMS_C2M
JTAG_VCCO_ON: R75.2 U10.8(2A1) U13.21(ADBUS4)
LS_OE_B: Q1.3(D) R69.1 U5.2(OE_B) U10.1(1~{OE})
PC4_CON_PGND: J7.13 Q1.1(G) Q2.3(D) R73.1 ; off-sheet PC4_CON_PGND
PS_POR_B: U9.6(Y1) ; off-sheet PS_POR_B
PS_SRST_C2M_B: J7.14 U9.4(Y2) ; off-sheet PS_SRST_C2M_B
SOM_UART1_RXD: U14.5(B1) ; off-sheet MIO37  [also labelled MIO37]
SOM_UART1_TXD: U14.4(B2) ; off-sheet MIO36  [also labelled MIO36]
USB_JTAG_DM_N: J10.A7(Dn1) J10.B7(Dn2) U13.7(DM) U33.2(D-) ; off-sheet USB_JTAG_DM_N
USB_JTAG_DM_P: J10.A6(Dp1) J10.B6(Dp2) U13.8(DP) U33.1(D+) ; off-sheet USB_JTAG_DM_P
USB_JTAG_VPHY: C99.1 C101.1 FB18.1 U13.4(VPHY)
USB_JTAG_VPLL: C100.1 C102.1 FB19.1 U13.9(VPLL)
NetC117_2: C117.2 U13.2(OSCI) Y5.1(1_Crystal)
NetC118_2: C118.2 U13.3(OSCO) Y5.3(2_Crystal)
NetJ10_1: J10.1(MNT_1) J10.2(MNT_2) J10.3(MNT_3) J10.4(MNT_4) R186.2
NetJ10_A5: J10.A5(CC1) R21.1
NetJ10_B5: J10.B5(CC2) R26.1
NetR74_2: R74.2 U10.15(1B1)
NetR78_2: R78.2 U13.14(RESET#)
NetR79_1: R79.1 R82.1 U15.4(DO)
NetR80_1: R80.1 U13.62(EECLK) U15.2(CLK)
NetR81_1: R81.1 U13.63(EECS) U15.1(CS)
NetR82_2: R82.2 U13.61(EEDATA) U15.3(DI)
NetR83_2: R83.2 U13.6(REF)

Not connected (* = marked no-connect by the designer): J7 12; U7 2(NC1)* 7(NC2)*; U10 9(2A2); U13 28(BDBUS2)* 29(BDBUS3)* 30(BDBUS4)* 32(BDBUS5)* 33(BDBUS6)* 34(BDBUS7)* 36(SUSPEND#)* 40(CDBUS2)* 41(CDBUS3)* 43(CDBUS4)* 44(CDBUS5)* 45(CDBUS6)* 46(CDBUS7)* 48(DDBUS0)* 53(DDBUS2)* 54(DDBUS3)* 55(DDBUS4)* 57(DDBUS5)* 58(DDBUS6)* 59(DDBUS7)*; U15 6(ORG_NC)* 7(NC)*; U33 3(ID) 5(NC)

### Layout directives
differential pair: USB_JTAG_DM_N, USB_JTAG_DM_P

### Notes on the sheet
- JTAG
- FTDI JTAG/UART
- USB_PWRD_VCCIO = 3.3V
- MIO UART, For ARM
- USB-C Vertical Flag
- HDIO UART, for FPGA

### Library data of the parts
C91 C92 C96 C99 C100 C103 C104 C106-C115 C119-C123 = CMP-2008-02519-2: General Purpose Ceramic Capacitor, 0402, 100nF, 10%, X7R, 15%, 25V; Package Quantity: 1; Capacitance: 100nF; Min Operating Temperature: -55°C; Voltage: 25V; Voltage Rating: 25V; Construction: Flat; Max Operating Temperature: 125°C; Radiation Hardening: No; Depth: 0.5mm; Thickness: 0.022inch; Voltage Rating (DC): 25V; Number of Pins: 2; Lead Free: Lead Free; Series: -; REACH SVHC: No SVHC; Length: 1mm; Dielectric: X7R; RoHS Compliant: Yes; Mount: Surface Mount; Packaging: Tape and Reel; Case/Package: 0402; Case Code (Imperial): 0402; Termination: SMD/SMT; Width: 0.02inch; Case Code (Metric): 1005; Tolerance: 10%
C93 = CMP-08246-002303-1: Cap Ceramic 1nF 50V X7R 10% Pad SMD 0402 +125°C Automotive T/R; Width: 0.02inch; Thickness: 0.022inch; Min Operating Temperature: -55°C; Mount: Surface Mount; Voltage Rating (DC): 50V; Voltage Rating: 50V; Termination: SMD/SMT; Capacitance: 1nF; Case/Package: 0402; Depth: 0.5mm; Length: 1mm; Ratings: AEC-Q200; Height: 0.5mm; Dielectric: X7R; Radiation Hardening: No; Lead Free: Lead Free; Composition: Ceramic; Max Operating Temperature: 125°C; Case Code (Imperial): 0402; Tolerance: 10%; Case Code (Metric): 1005; REACH SVHC: No SVHC; Package Quantity: 1; Packaging: Tape and Reel; Weight: 2.3E-05oz
C94 = CMP-2000-04979-3: Multilayer Ceramic Capacitors 10μF ±10% 10V X5R SMD 0603; Capacitance: 10uF; Dielectric Material: Ceramic; Construction: Flat; Height: 0.8mm; Thickness: 0.035inch; Case Code (Metric): 1608; Radiation Hardening: No; Number of Pins: 2; Voltage Rating (DC): 10V; Depth: 0.8mm; Voltage: 10V; RoHS Compliant: Yes; Voltage Rating: 10V; Package Quantity: 1; Resistor Type: Ceramic; Termination: SMD/SMT; Lead Free: Lead Free; REACH SVHC: No SVHC; Tolerance: 10%; Mount: Surface Mount; Series: C; Packaging: Tape and Reel; Width: 0.8mm; Dielectric: X5R; Weight: 7.1E-05oz; Length: 1.6mm; Max Operating Temperature: 85°C; Case Code (Imperial): 0603; Case/Package: 0603; Min Operating Temperature: -55°C
C95 = CMP-13271-004224-1: as C284 on sheet 09-DPLL-3; Width: 0.031inch; Voltage Rating: 25V; Length: 0.063inch; Case Code (Metric): 1608; Dielectric: X5R; Termination: Wraparound; Capacitance: 10uF; Lead Free: Lead Free; Mount: Surface Mount; Package Quantity: 1; Case Code (Imperial): 0603; Thickness: 0.035inch; Packaging: Tape and Reel; Contact Plating: Tin; Min Operating Temperature: -55°C; Tolerance: 20%; Max Operating Temperature: 85°C; Case/Package: 0603
C97 C98 = CMP-2000-05393-2: as C266 on sheet 09-DPLL-3; Voltage: 50V; Dielectric Material: Ceramic; Min Operating Temperature: -55°C; Depth: 0.5mm; Radiation Hardening: No; RoHS Compliant: Yes; Voltage Rating (DC): 50V; Lead Free: Lead Free; Resistor Type: Ceramic; Height: 0.5mm; Dielectric: X7R; Thickness: 0.022inch; Case/Package: 0402; Case Code (Metric): 1005; Termination: SMD/SMT; Capacitance: 100nF; Packaging: Tape and Reel; Max Operating Temperature: 125°C; Mount: Surface Mount; Package Quantity: 1; Width: 0.02inch; Weight: 2.3E-05oz; Voltage Rating: 50V; Tolerance: 10%; Construction: Flat; Case Code (Imperial): 0402; Length: 1mm; REACH SVHC: No SVHC; Series: C
C101 C102 C116 = CMP-08246-005457-1: CAP CER 4.7UF 6.3V X5R 0402; Dissipation Factor: 10%; Tolerance: 20%; Dielectric Material: Ceramic; Min Operating Temperature: -55°C; Construction: Flat; Voltage Rating (DC): 6.3V; Case Code (Metric): 1005; Voltage: 6.3V; Thickness: 0.026inch; Lead Free: Lead Free; Weight: 2.3E-05oz; Height: 0.5mm; Series: C; Case/Package: 0402; Capacitance: 4.7uF; Dielectric: X5R; Case Code (Imperial): 0402; Width: 0.02inch; Radiation Hardening: No; Packaging: Tape and Reel; Resistor Type: Ceramic; Termination: SMD/SMT; Max Operating Temperature: 85°C; REACH SVHC: No SVHC; Mount: Surface Mount; Package Quantity: 1; Length: 1mm; Voltage Rating: 6.3V; Depth: 0.5mm
C105 = CMP-13271-001051-1: Cap Ceramic 1uF 25V X5R ±10% SMD 0402 +85°C Paper T/R; Radiation Hardening: No; Lead Free: Lead Free; Capacitance: 1uF; Package Quantity: 10000; Max Operating Temperature: 85°C; Voltage Rating: 25V; Case/Package: 0402; Min Operating Temperature: -55°C; Packaging: Tape and Reel; Tolerance: 10%; Height: 0.5mm; Thickness: 0.022inch; Case Code (Metric): 1005; Width: 0.02inch; Case Code (Imperial): 0402; Dielectric: X5R; Length: 1mm; Mount: Surface Mount; Material: Ceramic; Depth: 0.5mm
C117 C118 = CMP-2008-03917-1: Part Number: GRM1555C1H270JA01D; Manufacturer: Murata
D4-D7 = CMP-1055-00559-1: Dual Series Schottky Barrier Diodes, 3-Pin SOT-323, Pb-Free, Tape and Reel; Manufacturer: On Semiconductor; trr Max (ns): 5; IFSM Max (A): 0.6; ComponentLink1URL: http://www.onsemi.com/; Mounting Technology: Surface Mount; ComponentLink1Description: Manufacturer URL; ComponentLink3URL: http://www.onsemi.com/pub_link/Collateral/419-04.PDF; RoHS: TRUE; PackageVersion: Rev. N, 11/2008; Packing: Tape and Reel; PackageReference: SOT-323-3-419-04; ComponentLink2URL: http://www.onsemi.cn/pub_link/Collateral/BAT54SWT1-D.PDF; ComponentLink3Description: Package Specification; PackageDescription: 3-Pin Small Outline Transistor, Body 2 x 1.25 mm, Pitch 0.65 mm; ComponentLink2Description: Datasheet; PartNumber: BAT54SWT1G; DatasheetVersion: Rev. 10; Configuration: Dual
FB12 FB13 FB18 FB19 = CMP-0220-00171-2: as FB8 on sheet 09-DPLL-3; Case Code (Metric): 1608; Core Material: Ferrite; Length: 1.6mm; Lead Free: Lead Free; Series: WE-CBF; Min Operating Temperature: -55°C; RoHS Compliant: Yes; Case/Package: SMD/SMT; Material: Ferrite; Max Operating Temperature: 125°C; Termination: SMD/SMT; Packaging: Tape and Reel; Weight: 0.000141oz; Case Code (Imperial): 0603; Width: 0.8mm; Mount: Surface Mount; Max Current Rating: 2A; Package Quantity: 1; Depth: 0.8mm; Current Rating: 2A; Height: 0.8mm
J7 = CMP-04776-000884-1: CONN HEADER SMD 14POS 2MM; Number of Circuits: 14; Glow Wire Compliant: Non-compliant; Gender: Male; Current Rating: 2A; Voltage Rating: 125V; Row Spacing: 2mm; Packaging: Tape and Reel; Package Quantity: 500; Number of Rows: 2; Reach SVHC Compliant: Yes; Series: 87832; Number of Positions: 14; RoHS Compliant: Yes; Termination: Solder; Pitch: 2mm; Mount: Surface Mount; Housing Material: Nylon; Contact Material: Bronze; Max Operating Temperature: 105°C; Radiation Hardening: No; Contact Gender: Male; Number of Contacts: 14; Contact Plating: Gold; Orientation: Vertical; Min Operating Temperature: -55°C
J10 = CMP-04767-000020-1: CONN RCPT USB2.0 TYPE C 24POS RA
Q1-Q3 = CMP-12801-000049-1: MOSFET N-CH 20V 230MA DFN; Manufacturer: Diodes Inc.; Threshold Vgs Max: 0.9V; Input Capacitace At Vds: 14.1pF @ 15V; Depletion Mode: False; Pulse Drain Current: 805mA; Threshold Vgs Min: 0.6V; Gate To Source Voltage: 10V; Max Junction Temp: +150°C; Turn On Delay Time: 3.8ns; Automotive Grade: Grade 0; Turn Off Delay Time: 13.4ns; Power Dissipation: 350mW; Standoff Height: 0mm; Transconductance: 0.242S; Number Of N Channels: 1; Drain To Source Resistance: 1.8Ω; Continuous Drain Current: 240mA; Max Forward Diode Voltage: 1.4V; Rthja Max: 357°C/W; Device Class L3: MOSFETs; Temperature: -55°C to +150°C; Footprint Url: https://www.diodes.com/assets/Package-Files/X2-DFN1006-3.pdf; Mouser Description: MOSFET ENHANCE MODE MOSFET 20V N-Chan; Device Class L1: Discrete Semiconductors; Height: 0.4mm; RoHS: TRUE; Digikey Description: MOSFET N-CH 20V 230MA DFN; Temperature Range Low: -55°C; Category: Trans; Temperature Range High: +150°C; Automotive: Yes; Drain To Source Voltage: 20V; ComponentLink2URL: https://www.diodes.com/assets/Datasheets/ds31775.pdf; Drain To Source Breakdown Voltage: 20V; ComponentLink2Description: Datasheet; Device Class L2: Transistors; Octopart: https://octopart.com/dmn26d0ufb4-7-diodes+inc.-17947794; Package: X2-DFN1006-3; Lead Free: Yes; Manufacturer Part Number: DMN26D0UFB4-7; Number Of Channels: 1
R21 R26 = CMP-2002-04046-1: Manufacturer: KOA Speer; Part Number: RK73H1ETTP5101F
R67 = CMP-2002-00996-1: Part Number: ERJ-2RKF5622X; Manufacturer: Panasonic
R68-R73 R75 R76 R79-R81 R84 R85 R223 R224 = CMP-2002-00433-1: Part Number: ERJ-2GEJ103X; Manufacturer: Panasonic
R74 R186 = CMP-2002-01772-2: as R245 on sheet 09-DPLL-3; Min Operating Temperature: -55°C; Termination: SMD/SMT; Case/Package: 0402; Case Code (Imperial): 0402; Packaging: Tape and Reel; Case Code (Metric): 1005; Max Operating Temperature: 155°C; Series: AC
R78 = CMP-2002-08277-1: Manufacturer: Vishay Dale; Part Number: CRCW04021K00FKTD
R82 = CMP-2002-06093-1: Manufacturer: Multicomp; Part Number: MC00625W040212K
R83 = CMP-2002-03841-1: Manufacturer: KOA Speer; Part Number: RK73H1ETTP1202F
R219-R222 = CMP-2002-07881-1: Part Number: RC0402FR-1333RL; Manufacturer: Yageo
U5 U11 U14 U16 = SN74AVC2T245: IC Lvl Trans 2-Bit Bidir 500Mbps 1.2-3.6V 50mA UQFN-10; Manufacturer PN: SN74AVC2T245RSWR; Manufacturer: TEXAS INSTRUMENTS; Agile Part Number: ICS-00048-01; EDMVersionID: 493023062; Barcode: 500012; PCB Footprint: QFN40P140X180X55-10; CIP Link: http://xsjbrdwin1/CIP-E/Component/Index/All?pn=500012; Part Type: BUS TRANSCEIVER
U7 = MP8904: IC LDO 6.5V 500mA Adj QFN-8; Manufacturer PN: MP8904DD-LF-Z; Manufacturer: Monolithic Power Systems Inc.; Agile Part Number: ICS-00581-01; EDMVersionID: 491667633; Barcode: 96000022; Datasheet: https://www.monolithicpower.com/pub/media/document/MP8904_r1.02.pdf; PCB Footprint: QFN_MP8904DD_8; Part Type: LDO; CIP Link: http://xsjbrdwin1/CIP-E/Component/Index/All?pn=96000022
U9 = NC7WZ07: IC Buffer Dual 5V 50mA 3.9nSec SC70-6 Open Drain; Manufacturer PN: NC7WZ07P6X; Manufacturer: ON Semiconductor; Agile Part Number: ICS-00102-01; Barcode: 500086; CIP Link: http://xsjbrdwin1/CIP-E/Component/Index/All?pn=500086; Part Type: CMOS LOGIC; ROHS: Yes; Family: CMOS LOGIC; PCB Footprint: SC70_6
U10 = CMP-2000-07132-1: Dual-Bit Bus Transceiver with Configurable Voltage Translation and 3-State Output, 1.2 to 3.6 V, -40 to 85 degC, 16-Pin UQFN (RSV), Green (RoHS & no Sb/Br), Tape and Reel; Manufacturer: Texas Instruments; Propagation Delay Time: 10.3ns; Polarity: Non-Inverting; Low Level Output Current: 12mA; High Level Output Current: -12mA; Quiescent Current: 80uA; Logic Family: AVC; Input Logic Level: CMOS; Number of  Elements: 2; Number of Channels: 4; Operating Supply Voltage (Typ): 1.8/2.5/3.3V; Operating Supply Voltage (Min): 1.2V; Operating Supply Voltage (Max): 3.6V; Technology: CMOS; Package Type: uQFN; Manufacturer URL: http://www.ti.com/; Packaging: TapeandReel; Package URL: http://www.ti.com/lit/ml/mpqf205c/mpqf205c.pdf; Pin Count: 16; Operating Temperature (Max): 85C; Mounting: SurfaceMount; Operating Temperature (Min): -40C; Operating Temperature Classification: Industrial; Package Reference: RSV0016A; Mounting Technology: SurfaceMount; Datasheet Version: Rev. G, 11/2014; Operating Temp Range: -40Cto85C; Rad Hardened: No; Datasheet URL: http://www.ti.com/lit/ds/symlink/sn74avc4t245.pdf; Output Logic Level: CMOS; Output Type: 3-State; Package Description: 16-Pin Quad Flat No-lead Package, Body 1.8 x 2.6 mm, Pitch 0.4 mm
U13 = FT4232HL
U15 = 93LC56B: IC EEPROM 2Kb 128x16-Bit Serial 2MHz 2.5V SOIC-8; Manufacturer PN: 93LC56B-I/SN; Manufacturer: MICROCHIP; Agile Part Number: ICS-00335-01; Barcode: 500495; ROHS: YES; Family: MEMORY; Part Type: MEMORY; CIP Link: http://xsjbrdwin1/CIP-E/Component/Index/All?pn=500495; PCB Footprint: SOIC8P127W390
U33 = CMP-0326-00038-4: TVS DIODE 5.5V 6SON; Breakdown Voltage: 24V; Interface: USB; ESD Protection: Yes; Peak Pulse Power: 60W; Number of Circuits: 4; Polarity: Unidirectional; Capacitance: 15pF; Test Current: 1mA; Working Voltage: 19V; Min Breakdown Voltage: 6V; Peak Pulse Current: 3A; Operating Supply Voltage: 950mV; Max Operating Temperature: 85°C; Packaging: Tape and Reel; Termination: SMD/SMT; Number of Pins: 6; Radiation Hardening: No; Width: 1.05mm; REACH SVHC: No SVHC; Lead Free: Lead Free; Depth: 1mm; Package Quantity: 5000; Length: 1.45mm; Direction: Unidirectional; Min Operating Temperature: -40°C; Number of Channels: 4; Max Power Dissipation: 60W; Height: 0.55mm
Y5 = CMP-27762-011014-1: Crystal 12MHz ±30ppm 10pF SMD-4 2.5mm x 2mm Automotive; Frequency Stability: 50ppm; ESR (Equivalent Series Resistance): 150R; Max Operating Temperature: 125°C; Frequency Tolerance: 30ppm; Frequency: 12MHz; RoHS Compliant: Yes; Mount: Surface Mount; Packaging: Tape and Reel; Case/Package: SMD/SMT; Load Capacitance: 10pF; Min Operating Temperature: -40°C; Length: 0.098inch; Height: 0.024inch; Width: 0.079inch; Ratings: AEC-Q200

## Sheet 11-DisplayPort.SchDoc
size B; SheetNumber: 11; SheetTotal: 22
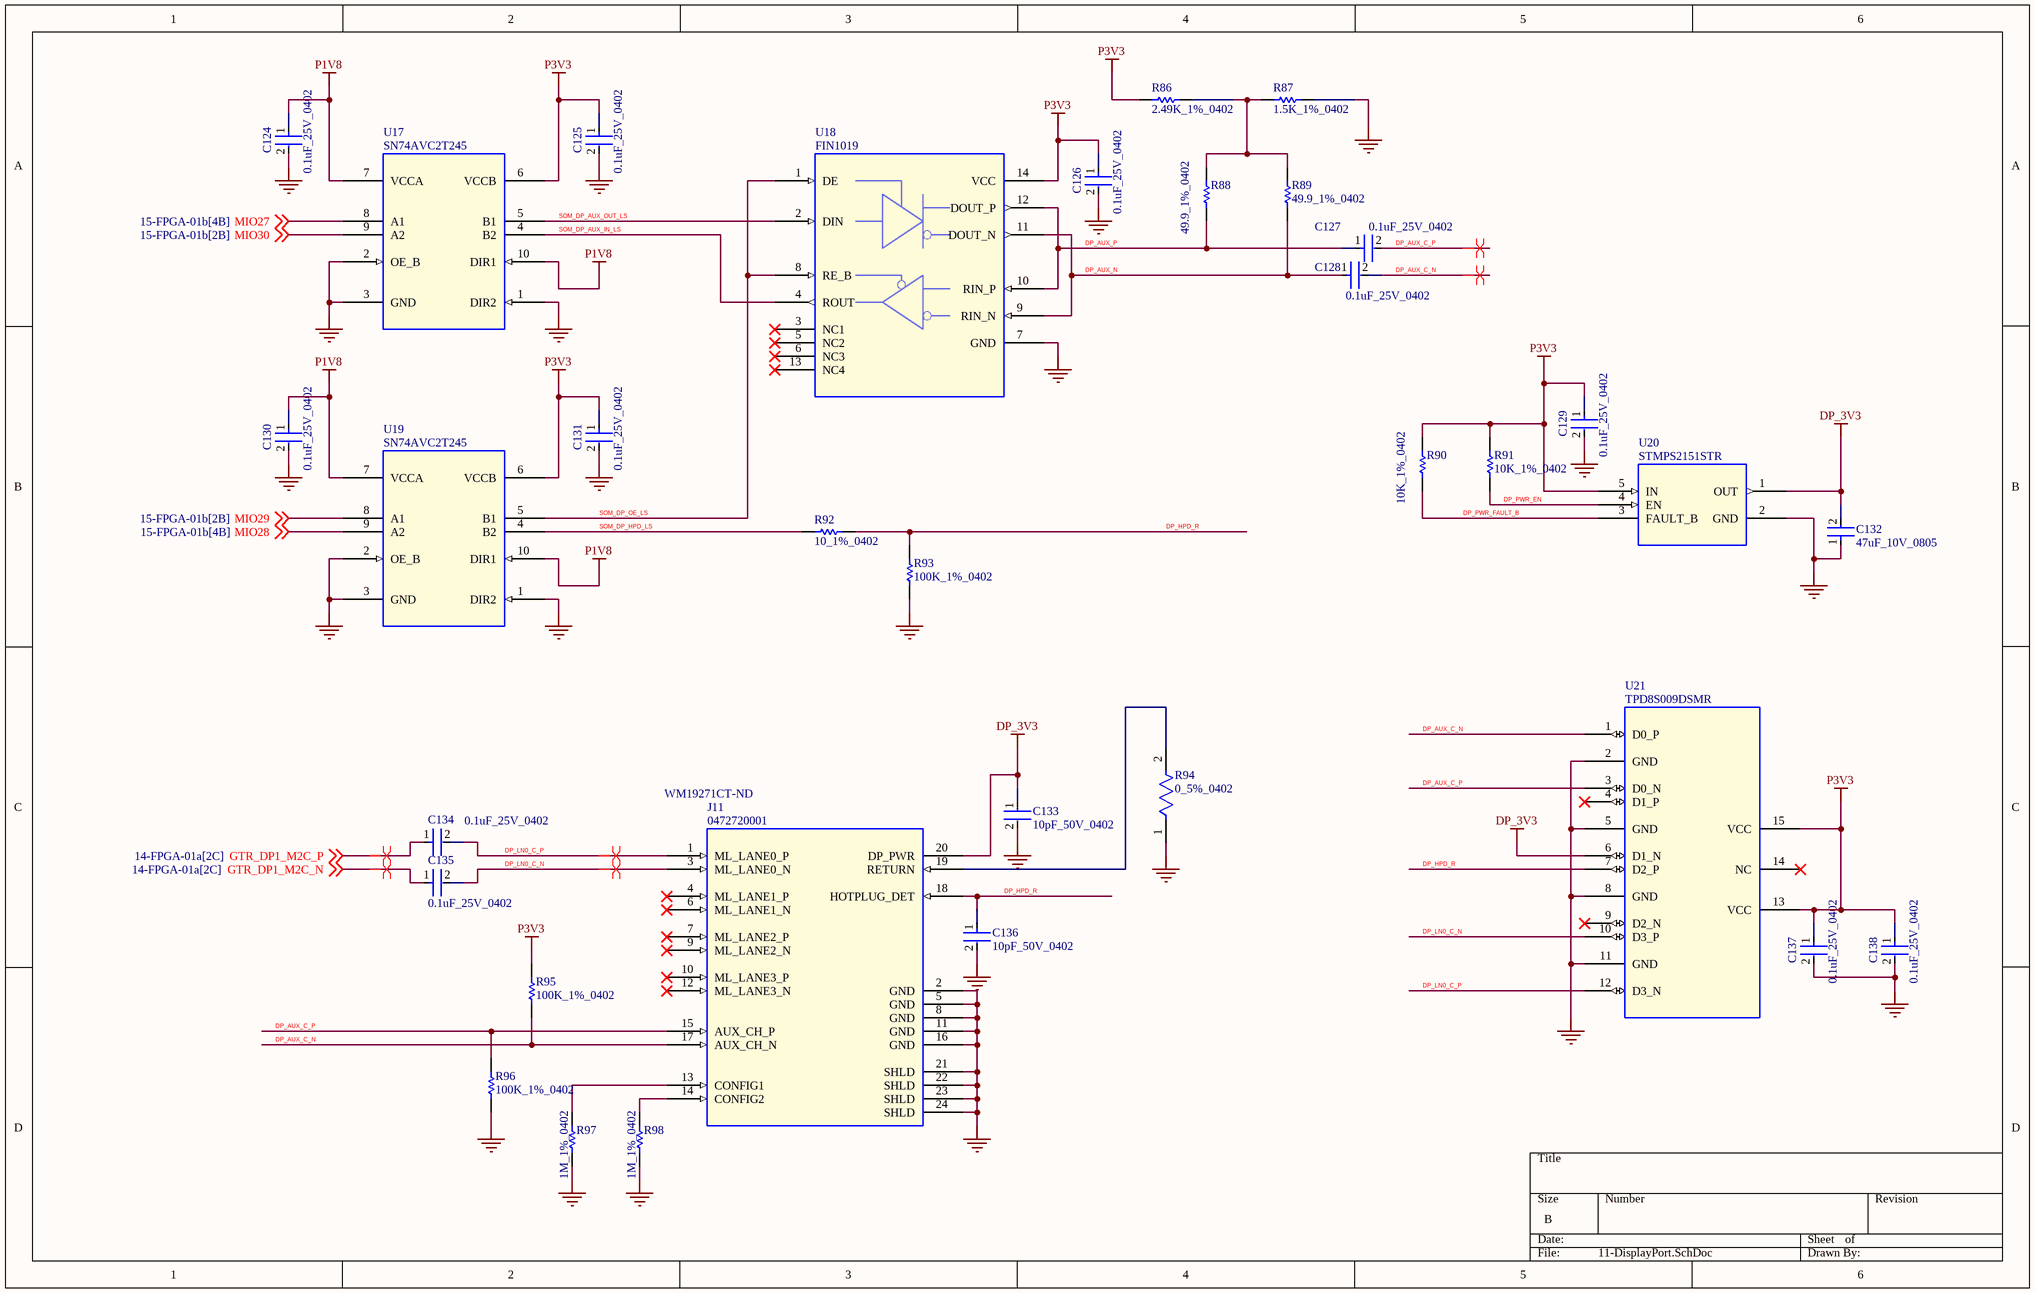
[diagram p11: 11-DisplayPort.SchDoc]

### Parts
C124  0.1uF_25V_0402  [FP-0402-L_1_0_1-W_0_5_0_1-IPC_C]
C125  0.1uF_25V_0402  [FP-0402-L_1_0_1-W_0_5_0_1-IPC_C]
C126  0.1uF_25V_0402  [FP-0402-L_1_0_1-W_0_5_0_1-IPC_C]
C127  0.1uF_25V_0402  [FP-0402-L_1_0_1-W_0_5_0_1-IPC_C]
C128  0.1uF_25V_0402  [FP-0402-L_1_0_1-W_0_5_0_1-IPC_C]
C129  0.1uF_25V_0402  [FP-0402-L_1_0_1-W_0_5_0_1-IPC_C]
C130  0.1uF_25V_0402  [FP-0402-L_1_0_1-W_0_5_0_1-IPC_C]
C131  0.1uF_25V_0402  [FP-0402-L_1_0_1-W_0_5_0_1-IPC_C]
C132  47uF_10V_0805  [FP-GRM21B-0_2-e0_2_0_7-IPC_A]
C133  10pF_50V_0402  [FP-C1005-050-0_05-IPC_C]
C134  0.1uF_25V_0402  [FP-0402-L_1_0_1-W_0_5_0_1-IPC_C]
C135  0.1uF_25V_0402  [FP-0402-L_1_0_1-W_0_5_0_1-IPC_C]
C136  10pF_50V_0402  [FP-C1005-050-0_05-IPC_C]
C137  0.1uF_25V_0402  [FP-0402-L_1_0_1-W_0_5_0_1-IPC_C]
C138  0.1uF_25V_0402  [FP-0402-L_1_0_1-W_0_5_0_1-IPC_C]
J11  0472720001  Supplier Part Number 1: WM19271CT-ND  [CON_MOLEX_47272]
R86  2.49K_1%_0402  [RESC1005X40X25ML05T05]
R87  1.5K_1%_0402  [RESC1005X40X25NL05T05]
R88  49.9_1%_0402  [RESC1005X40X25NL10T10]
R89  49.9_1%_0402  [RESC1005X40X25NL10T10]
R90  10K_1%_0402  [RESC1005X40X25ML05T05]
R91  10K_1%_0402  [RESC1005X40X25ML05T05]
R92  10_1%_0402  [RESC1005X40X25LL10T10]
R93  100K_1%_0402  [RESC1005X40X25ML05T05]
R94  0_5%_0402  [FP-AC0402-0_37-IPC_B]
R95  100K_1%_0402  [RESC1005X40X25ML05T05]
R96  100K_1%_0402  [RESC1005X40X25ML05T05]
R97  1M_1%_0402  [RESC1005X40X25NL10T10]
R98  1M_1%_0402  [RESC1005X40X25NL10T10]
U17  SN74AVC2T245  [QFN40P140X180X55-10]
U18  FIN1019  [TSSOP_14]
U19  SN74AVC2T245  [QFN40P140X180X55-10]
U20  STMPS2151STR  [SOT95P280X145_5]
U21  TPD8S009DSMR  [SON_15P]

### Nets
DP_3V3: C132.2 C133.1 J11.20(DP_PWR) U20.1(OUT) U21.6(D1_N)
GND: C124.2 C125.2 C126.2 C129.2 C130.2 C131.2 C132.1 C133.2 C136.2 C137.2 C138.2 J11.2(GND) J11.5(GND) J11.8(GND) J11.11(GND) J11.16(GND) J11.21(SHLD) J11.22(SHLD) J11.23(SHLD) J11.24(SHLD) R87.2 R93.2 R94.1 R96.1 R97.1 R98.1 U17.1(DIR2) U17.2(OE_B) U17.3(GND) U18.7(GND) U19.1(DIR2) U19.2(OE_B) U19.3(GND) U20.2(GND) U21.2(GND) U21.5(GND) U21.8(GND) U21.11(GND)
P1V8: C124.1 C130.1 U17.7(VCCA) U17.10(DIR1) U19.7(VCCA) U19.10(DIR1)
P3V3: C125.1 C126.1 C129.1 C131.1 C137.1 C138.1 R86.1 R90.2 R91.1 R95.2 U17.6(VCCB) U18.14(VCC) U19.6(VCCB) U20.5(IN) U21.13(VCC) U21.15(VCC)
DP_AUX_C_N: C128.2 J11.17(AUX_CH_N) R95.1 U21.1(D0_P)
DP_AUX_C_P: C127.2 J11.15(AUX_CH_P) R96.2 U21.3(D0_N)
DP_AUX_N: C128.1 R89.1 U18.9(RIN_N) U18.11(DOUT_N)
DP_AUX_P: C127.1 R88.1 U18.10(RIN_P) U18.12(DOUT_P)
DP_HPD_R: C136.1 J11.18(HOTPLUG_DET) R92.2 R93.1 U21.7(D2_P)
DP_LN0_C_N: C135.2 J11.3(ML_LANE0_N) U21.10(D3_P)
DP_LN0_C_P: C134.2 J11.1(ML_LANE0_P) U21.12(D3_N)
DP_PWR_EN: R91.2 U20.4(EN)
DP_PWR_FAULT_B: R90.1 U20.3(FAULT_B)
GTR_DP1_M2C_N: C135.1 ; off-sheet GTR_DP1_M2C_N
GTR_DP1_M2C_P: C134.1 ; off-sheet GTR_DP1_M2C_P
MIO27: U17.8(A1) ; off-sheet MIO27
MIO28: U19.9(A2) ; off-sheet MIO28
MIO29: U19.8(A1) ; off-sheet MIO29
MIO30: U17.9(A2) ; off-sheet MIO30
SOM_DP_AUX_IN_LS: U17.4(B2) U18.4(ROUT)
SOM_DP_AUX_OUT_LS: U17.5(B1) U18.2(DIN)
SOM_DP_HPD_LS: R92.1 U19.4(B2)
SOM_DP_OE_LS: U18.1(DE) U18.8(RE_B) U19.5(B1)
NetJ11_13: J11.13(CONFIG1) R97.2
NetJ11_14: J11.14(CONFIG2) R98.2
NetJ11_19: J11.19(RETURN) R94.2
NetR86_2: R86.2 R87.1 R88.2 R89.2

Not connected (* = marked no-connect by the designer): J11 4(ML_LANE1_P)* 6(ML_LANE1_N)* 7(ML_LANE2_P)* 9(ML_LANE2_N)* 10(ML_LANE3_P)* 12(ML_LANE3_N)*; U18 3(NC1)* 5(NC2)* 6(NC3)* 13(NC4)*; U21 4(D1_P)* 9(D2_N)* 14(NC)*

### Layout directives
differential pair: DP_AUX_C_N, DP_AUX_C_P, DP_LN0_C_N, DP_LN0_C_P, GTR_DP1_M2C_N, GTR_DP1_M2C_P

### Library data of the parts
C124-C131 C134 C135 C137 C138 = CMP-2008-02519-2: as C91 on sheet 10-JTAG; Package Quantity: 1; Capacitance: 100nF; Min Operating Temperature: -55°C; Voltage: 25V; Voltage Rating: 25V; Construction: Flat; Max Operating Temperature: 125°C; Radiation Hardening: No; Depth: 0.5mm; Thickness: 0.022inch; Voltage Rating (DC): 25V; Number of Pins: 2; Lead Free: Lead Free; Series: -; REACH SVHC: No SVHC; Length: 1mm; Dielectric: X7R; RoHS Compliant: Yes; Mount: Surface Mount; Packaging: Tape and Reel; Case/Package: 0402; Case Code (Imperial): 0402; Termination: SMD/SMT; Width: 0.02inch; Case Code (Metric): 1005; Tolerance: 10%
C132 = CMP-2000-06341-2: Chip Multilayer Ceramic Capacitors for General Purpose, 0805, 47uF, X5R, 15%, 20%, 10V; Dissipation Factor: 0.035%; Length: 2mm; Voltage Rating: 10V; Mount: Surface Mount; Width: 0.049inch; Voltage Rating (DC): 10V; Lead Free: Lead Free; REACH SVHC: No SVHC; Termination: SMD/SMT; Case/Package: 0805; Dielectric: X5R; Capacitance: 47uF; Packaging: Tape and Reel; Max Operating Temperature: 85°C; Tolerance: 20%; Thickness: 0.057inch; Dielectric Material: Ceramic; Min Operating Temperature: -55°C; Height: 1.25mm; Case Code (Imperial): 0805; Case Code (Metric): 2012; Depth: 1.25mm; Voltage: 10V
C133 C136 = CMP-08246-002674-1: CAP CER 10PF 50V C0G 0402; Temperature Coefficient: 30ppm/°C; Dielectric Material: Ceramic; Termination: SMD/SMT; Width: 0.02inch; Case Code (Metric): 1005; Thickness: 0.022inch; Height: 0.5mm; REACH SVHC: No SVHC; Case Code (Imperial): 0402; Voltage: 50V; Capacitance: 10pF; Max Operating Temperature: 125°C; Length: 1mm; Construction: Flat; Packaging: Tape and Reel; Lead Free: Lead Free; Series: C; Depth: 0.5mm; Dielectric: C0G; Package Quantity: 1; Mount: Surface Mount; Voltage Rating (DC): 50V; Voltage Rating: 50V; Case/Package: 0402; RoHS Compliant: Yes; Min Operating Temperature: -55°C; Number of Pins: 2; Radiation Hardening: No; Weight: 2.3E-05oz
J11 = 0472720001: Conn Rcpt DisplayPort Female RA 20 Pos 0.5mm P Black SMT; Agile Part Number: CON-00139-01; Manufacturer: MOLEX; EDMVersionID: 488745758; Barcode: 400070; Part Type: RECEPTACLE; CIP Link: http://xsjbrdwin1/CIP-E/Component/Index/All?pn=400070; Manufacturer PN: 0472720001; PCB Footprint: CON_MOLEX_47272; Supplier 1: Digi-Key
R86 = CMP-2002-00377-1: Manufacturer: Vishay Dale; Part Number: CRCW04022K49FKTD
R87 = CMP-2002-08297-1: Part Number: CRCW04021K50FKED; Manufacturer: Vishay Dale
R88 R89 = CMP-2002-04448-1: as R195 on sheet 09-DPLL-3
R90 R91 = CMP-2002-00433-1: as R68 on sheet 10-JTAG
R92 = CMP-2002-04187-1: Part Number: RK73H1ETTP10R0F; Manufacturer: KOA Speer
R93 R95 R96 = CMP-1011-00736-2: Part Number: CRCW0402100KFKTD; Manufacturer: Vishay Dale
R94 = CMP-2002-01772-2: as R245 on sheet 09-DPLL-3; Min Operating Temperature: -55°C; Termination: SMD/SMT; Case/Package: 0402; Case Code (Imperial): 0402; Packaging: Tape and Reel; Case Code (Metric): 1005; Max Operating Temperature: 155°C; Series: AC
R97 R98 = CMP-2002-05706-1: Manufacturer: TE Connectivity / AMP; Part Number: CRG0402F1M0
U17 U19 = SN74AVC2T245: IC Lvl Trans 2-Bit Bidir 500Mbps 1.2-3.6V 50mA UQFN-10; Agile Part Number: ICS-00048-01; Manufacturer: TEXAS INSTRUMENTS; Manufacturer PN: SN74AVC2T245RSWR; EDMVersionID: 493023062; Barcode: 500012; Part Type: BUS TRANSCEIVER; CIP Link: http://xsjbrdwin1/CIP-E/Component/Index/All?pn=500012; PCB Footprint: QFN40P140X180X55-10
U18 = FIN1019: IC Lvl Trans LVTTL-LVDS Diff 400Mbps 3.3V 2.5nSec TSSOP-14; Agile Part Number: ICS-00279-01; Manufacturer: FAIRCHILD; Manufacturer PN: FIN1019MTCX; EDMVersionID: 489931726; Barcode: 500414; Part Type: LVDS DRIVER/RECEIVER; CIP Link: http://xsjbrdwin1/CIP-E/Component/Index/All?pn=500414; PCB Footprint: TSSOP_14
U20 = STMPS2151: IC Switch Power 500mA 2.7-5.5V 110mR SOT23-5; Agile Part Number: ICS-00662-01; Manufacturer: STMicroelectronics; Supply Voltage: Not Required; Barcode: 50000178; CIP Link: http://xsjbrdwin1/CIP-E/Component/Index/All?pn=50000178; Part Type: LOAD SWITCH; Manufacturer PN: STMPS2151STR; Datasheet: http://www.st.com/content/ccc/resource/technical/document/datasheet/e8/d7/48/25/eb/87/45/b3/CD00167470.pdf/files/CD00167470.pdf/jcr:content/translations/en.CD00167470.pdf; PCB Footprint: SOT95P280X145_5
U21 = TPD8S009DSMR: TVSD 8-Ch 5.5V 2.5A 25W 4GHz SON-15 8KV Contact Discharge; Agile Part Number: ICS-00196-01; Manufacturer: TEXAS INSTRUMENTS; EDMVersionID: 493517914; Barcode: 500262; PCB Footprint: SON_15P; CIP Link: http://xsjbrdwin1/CIP-E/Component/Index/All?pn=500262; Part Type: ESD PROTECTOR; Manufacturer PN: TPD8S009DSMR